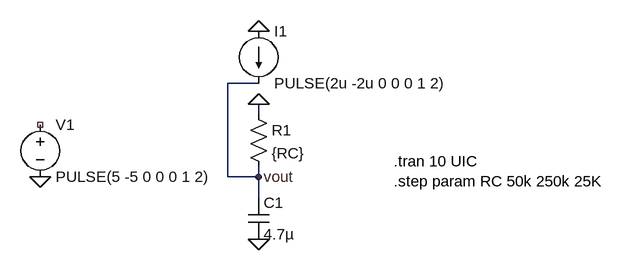
[diagram p0: schematic Draft1.asc]
Draft1.asc, the LTspice schematic file:
Version 4
SHEET 1 880 680
WIRE 304 192 256 192
WIRE 304 240 304 224
WIRE 256 336 256 192
WIRE 304 336 304 320
WIRE 304 336 256 336
WIRE 304 368 304 336
FLAG 304 112 0
FLAG 304 432 0
FLAG 304 336 vout
FLAG -32 336 0
FLAG 304 224 0
SYMBOL res 288 224 R0
SYMATTR InstName R1
SYMATTR Value {RC}
SYMBOL cap 288 368 R0
SYMATTR InstName C1
SYMATTR Value 4.7µ
SYMBOL current 304 112 R0
SYMATTR InstName I1
SYMATTR Value PULSE(2u -2u 0 0 0 1 2)
SYMBOL voltage -32 240 R0
SYMATTR InstName V1
SYMATTR Value PULSE(5 -5 0 0 0 1 2)
TEXT 512 312 Left 2 !.tran 10 UIC\n.step param RC 50k 250k 25K

The netlist it stands for:
* Draft1.asc
R1 0 vout {RC}
C1 vout 0 4.7µ
I1 0 vout PULSE(2u -2u 0 0 0 1 2)
V1 NC_01 0 PULSE(5 -5 0 0 0 1 2)
.tran 10 UIC
.step param RC 50k 250k 25K
.backanno
.end